# EAGLE design ESP8266-1W-I2C-Gateway_V2.00 (EAGLE 7.7.0)
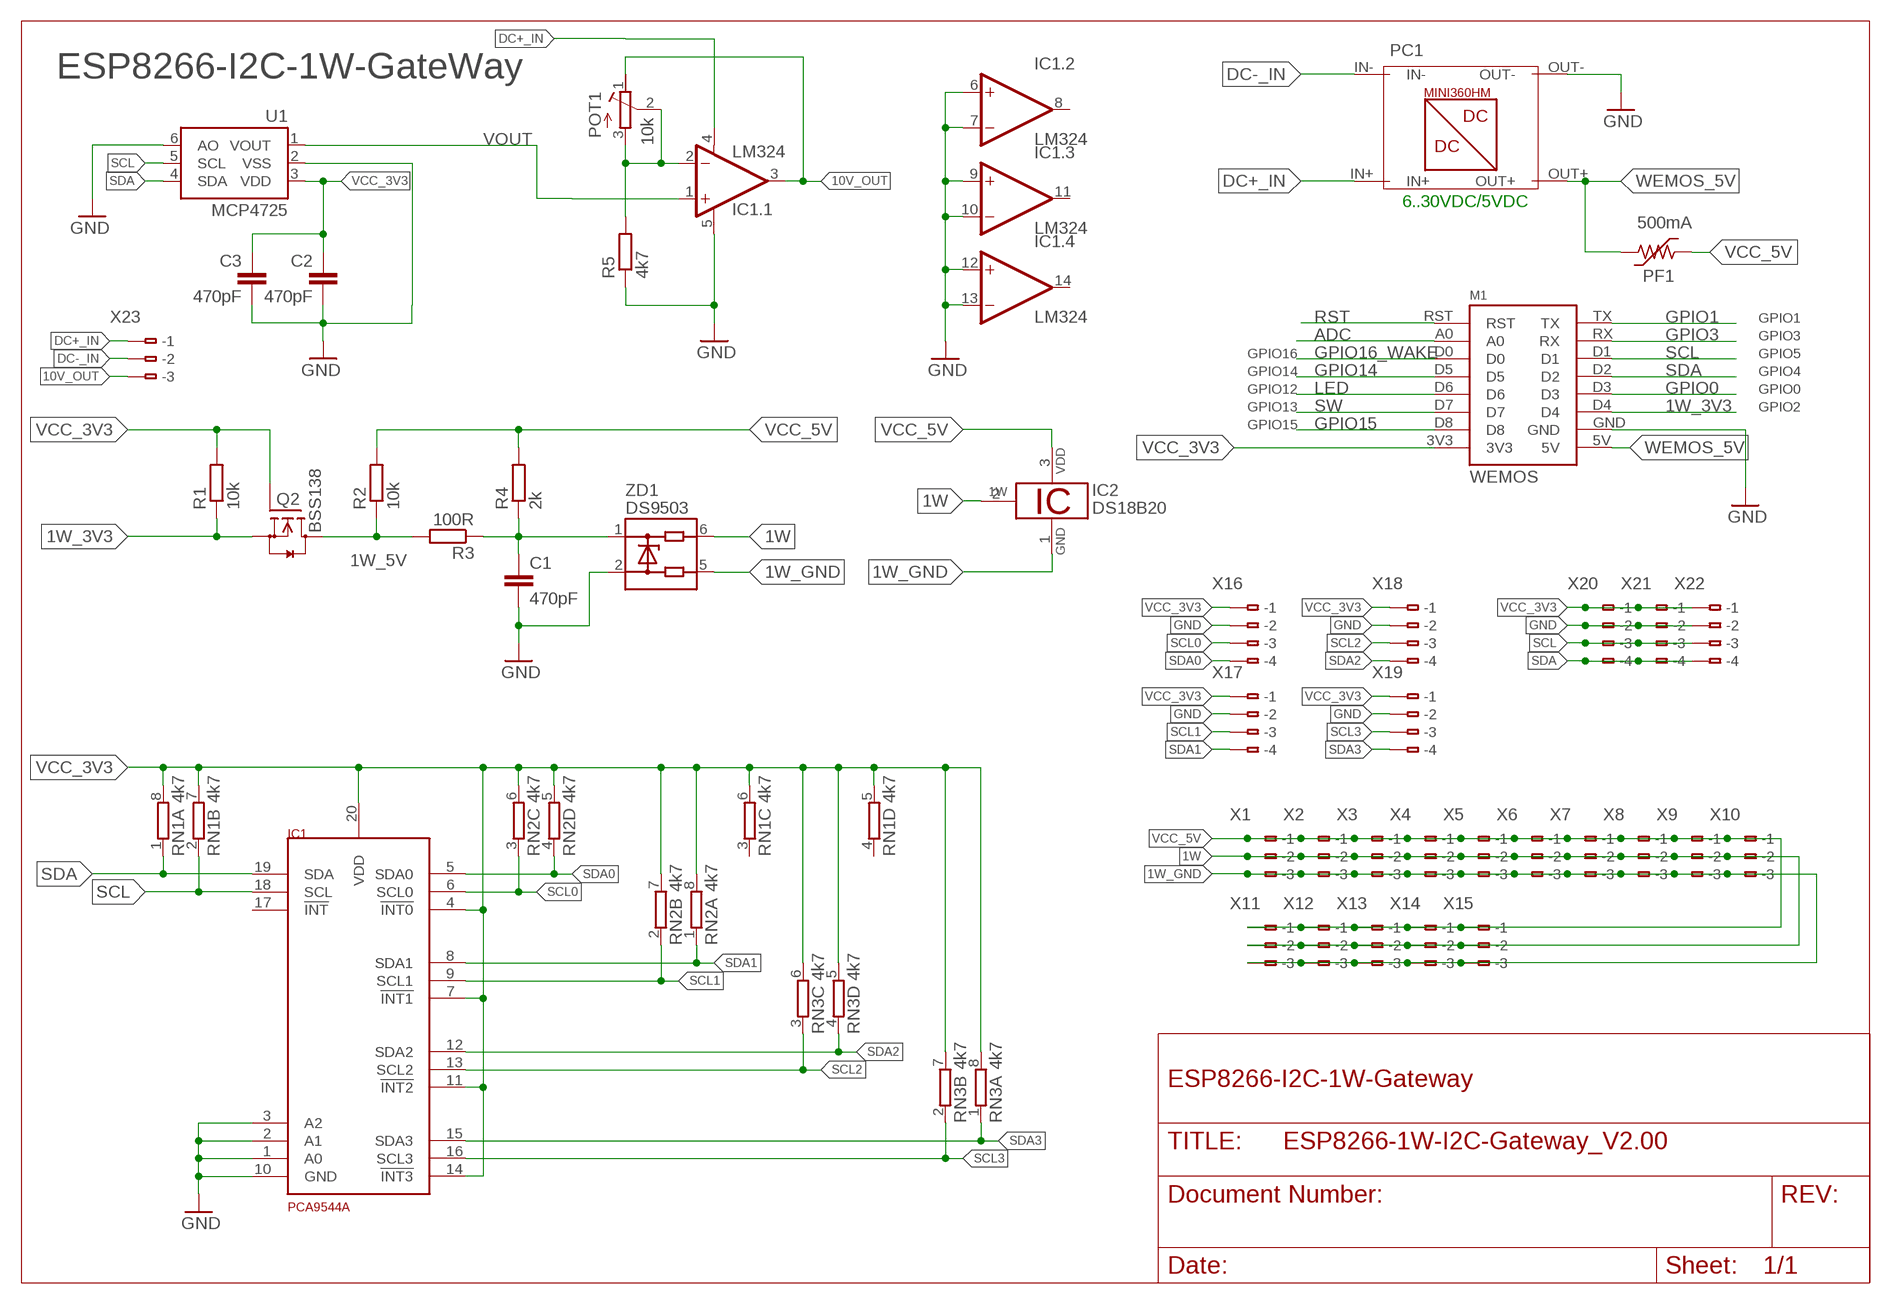
[diagram p0: schematic, sheet 1]

## Parts
C1  470pF  C-EUC0805  [C0805]
C2  470pF  C-EUC0805  [C0805]
C3  470pF  C-EUC0805  [C0805]
IC1  PCA9544A  [TSSOP20]
IC1.  LM324  [2QSP14]
IC2  DS18B20  [TO92-]
M1  WEMOS  [WEMOS]
PC1  MINI360HMTHROUGH-HOLE  [MINI360HM]
PF1  500mA  PTC-F1206  [F1206]
POT1  10k  BOURN_SMD_POTENTIOMETER2.1X2.7MMPACKAGE  [BOURN_SMD_POTENTIOMETER]
Q2  BSS138  [SOT23]
R1  10k  R-EU_R0805  [R0805]
R2  10k  R-EU_R0805  [R0805]
R3  100R  R-EU_R0805  [R0805]
R4  2k  R-EU_R0805  [R0805]
R5  4k7  R-EU_R0805  [R0805]
RN1  4k7  4R-N0603-ARC  [0603-ARC]
RN2  4k7  4R-N0603-ARC  [0603-ARC]
RN3  4k7  4R-N0603-ARC  [0603-ARC]
U1  MCP4725  MCP4725SOT-23  [SOT23-6]
X1  MINI_3X  [MINI_3X]
X2  MINI_3X  [MINI_3X]
X3  MINI_3X  [MINI_3X]
X4  MINI_3X  [MINI_3X]
X5  MINI_3X  [MINI_3X]
X6  MINI_3X  [MINI_3X]
X7  MINI_3X  [MINI_3X]
X8  MINI_3X  [MINI_3X]
X9  MINI_3X  [MINI_3X]
X10  MINI_3X  [MINI_3X]
X11  MINI_3X  [MINI_3X]
X12  MINI_3X  [MINI_3X]
X13  MINI_3X  [MINI_3X]
X14  MINI_3X  [MINI_3X]
X15  MINI_3X  [MINI_3X]
X16  MINI_4X  [MINI_4X]
X17  MINI_4X  [MINI_4X]
X18  MINI_4X  [MINI_4X]
X19  MINI_4X  [MINI_4X]
X20  MINI_4X  [MINI_4X]
X21  MINI_4X  [MINI_4X]
X22  MINI_4X  [MINI_4X]
X23  MINI_3X  [MINI_3X]
ZD1  DS9503  DS9503_BYPASS_JP  [TSOC6_BYPASS_J]

## Nets
1W: IC2.2(1W) X1.B-2(-2) X2.B-2(-2) X3.B-2(-2) X4.B-2(-2) X5.B-2(-2) X6.B-2(-2) X7.B-2(-2) X8.B-2(-2) X9.B-2(-2) X10.B-2(-2) X11.B-2(-2) X12.B-2(-2) X13.B-2(-2) X14.B-2(-2) X15.B-2(-2) ZD1.6
1W_3V3: M1.D4 Q2.2(S) R1.1
1W_5V: Q2.3(D) R2.1 R3.2
1W_GND: IC2.1(GND) X1.B-3(-3) X2.B-3(-3) X3.B-3(-3) X4.B-3(-3) X5.B-3(-3) X6.B-3(-3) X7.B-3(-3) X8.B-3(-3) X9.B-3(-3) X10.B-3(-3) X11.B-3(-3) X12.B-3(-3) X13.B-3(-3) X14.B-3(-3) X15.B-3(-3) ZD1.5
10V_OUT: IC1..3(1:OUT) POT1.1(A) X23.B-3(-3)
ADC: M1.A0
DC+_IN: IC1..4(1:V+) PC1.IN+ X23.B-1(-1)
DC-_IN: PC1.IN- X23.B-2(-2)
GND: C1.2 C2.2 C3.2 IC1.1(A0) IC1.2(A1) IC1.3(A2) IC1.10(GND) IC1..5(1:V-) IC1..6(2:+IN) IC1..7(2:-IN) IC1..9(3:+IN) IC1..10(3:-IN) IC1..12(4:+IN) IC1..13(4:-IN) M1.GND PC1.OUT- R5.1 U1.2(VSS) U1.6(AO) X16.B-2(-2) X17.B-2(-2) X18.B-2(-2) X19.B-2(-2) X20.B-2(-2) X21.B-2(-2) X22.B-2(-2) ZD1.2
GPIO0: M1.D3
GPIO1: M1.TX
GPIO3: M1.RX
GPIO14: M1.D5
GPIO15: M1.D8
GPIO16_WAKE: M1.D0
LED: M1.D6
N$4: IC1..2(1:-IN) POT1.2(S) POT1.3(E) R5.2
N$5: C1.1 R3.1 R4.1 ZD1.1
RST: M1.RST
SCL: IC1.18(SCL) M1.D1 RN1.2 U1.5(SCL) X20.B-3(-3) X21.B-3(-3) X22.B-3(-3)
SCL0: IC1.6(SCL0) RN2.3 X16.B-3(-3)
SCL1: IC1.9(SCL1) RN2.2 X17.B-3(-3)
SCL2: IC1.13(SCL2) RN3.3 X18.B-3(-3)
SCL3: IC1.16(SCL3) RN3.2 X19.B-3(-3)
SDA: IC1.19(SDA) M1.D2 RN1.1 U1.4(SDA) X20.B-4(-4) X21.B-4(-4) X22.B-4(-4)
SDA0: IC1.5(SDA0) RN2.4 X16.B-4(-4)
SDA1: IC1.8(SDA1) RN2.1 X17.B-4(-4)
SDA2: IC1.12(SDA2) RN3.4 X18.B-4(-4)
SDA3: IC1.15(SDA3) RN3.1 X19.B-4(-4)
SW: M1.D7
VCC_3V3: C2.1 C3.1 IC1.4(!INT0) IC1.7(!INT1) IC1.11(!INT2) IC1.14(!INT3) IC1.20(VDD) M1.3V3 Q2.1(G) R1.2 RN1.5 RN1.6 RN1.7 RN1.8 RN2.5 RN2.6 RN2.7 RN2.8 RN3.5 RN3.6 RN3.7 RN3.8 U1.3(VDD) X16.B-1(-1) X17.B-1(-1) X18.B-1(-1) X19.B-1(-1) X20.B-1(-1) X21.B-1(-1) X22.B-1(-1)
VCC_5V: IC2.3(VDD) PF1.1 R2.2 R4.2 X1.B-1(-1) X2.B-1(-1) X3.B-1(-1) X4.B-1(-1) X5.B-1(-1) X6.B-1(-1) X7.B-1(-1) X8.B-1(-1) X9.B-1(-1) X10.B-1(-1) X11.B-1(-1) X12.B-1(-1) X13.B-1(-1) X14.B-1(-1) X15.B-1(-1)
VOUT: IC1..1(1:+IN) U1.1(VOUT)
WEMOS_5V: M1.5V PC1.OUT+ PF1.2
Unconnected: IC1.17(!INT) IC1..8(2:OUT) IC1..11(3:OUT) IC1..14(4:OUT) RN1.3 RN1.4

## Notes on the sheet
- ESP8266-I2C-1W-GateWay
- 6..30VDC/5VDC
- GPIO1
- GPIO3
- GPIO16 | GPIO5
- GPIO14 | GPIO4
- GPIO12 | GPIO0
- GPIO13 | GPIO2
- GPIO15
- ESP8266-I2C-1W-Gateway

## Library data of the parts
C1-C3 = resistor:C-EU: CAPACITOR, European symbol
IC1 = DSSCircuits:PCA9544A
IC1. = seanvoisen:LM324: LM324 Quad Op-amp
IC2 = my:DS18B20: Programmable Resolution Digital Thermometer This chip provides a onewire thermosensor with approx. 0.5°C accuracy. A programmable over/undertemperure alarm is available. The precision can be set from 9..12 bits. Notes: Vdd must be applied for accurate measurements at low temperatures, as the parasite power circuit otherwise heats the sensor. If parasite power is used, Vdd has to be connected to GND. The DS1822 is a low-cost thermometer chip, the DS18S20 is similar to the DS18B20, but with 9 Bit precision only. Author: Jan Kandziora <jjj@gmx.de>
M1 = 1455413453956-wemos:WEMOS
PC1 = ESP8266_1wire_Gateway_V1.15:MINI360HM
PF1 = polyswitch:PTC-: POLYSWITCH Polyswitch Resetable Fuses
POT1 = bourn_smd_potentiometers:BOURN_SMD_POTENTIOMETER: Bourn : SMD Potentiometer Part #: PVZ2A103C04B00 Mouser: http://www.mouser.com/ProductDetail/Murata-Electronics/PVZ2A103C04B00/?qs=sGAEpiMZZMvygUB3GLcD7qR9snKKmVdv8nMA43nZMQ4%3d Digikey: http://www.digikey.com/scripts/dksearch/dksus.dll?pv7=2&k=PVZ2A103C04B00&mnonly=0&newproducts=0&ColumnSort=0&page=1&quantity=0&ptm=0&fid=0&pageSize=25 Dimensions: (2.1mm x 2.7mm) http://search.murata.co.jp/Ceramy/CatalogshowpageAction.do?sParam=PVZ2A&sKno=G002&sTblid=A002&sDirnm=A00X&sFilnm=PVZ2A4DM&sType=2&sLang=en&sNHinnm=PVZ2A103C04B00&sCapt=Dimensions
Q2 = my:BSS138: Fairchild Semiconductors BSS138 N-Channel Logic Level Enhancement Mode Field Effect Transistor General Description: These N-Channel enhancement mode field effect transistors are produced using Fairchild's proprietary, high cell density, DMOS technology. These products have been designed to minimize on-state resistance while provide rugged, reliable, and fast switching performance.These products are particularly suited for low voltage, low current applications such as small servo motor control, power MOSFET gate drivers, and other switching applications. Features: 0.22 A, 50 V. RDS(ON) = 3.5Ohm @ VGS = 10 V RDS(ON) = 6.0Ohm @ VGS = 4.5 V High density cell design for extremely low RDS(ON) Rugged and Reliable Compact industry standard SOT-23 surface mount package Please send any comments to: messi@users.sourceforge.net
R1-R5 = rcl:R-EU_: RESISTOR, European symbol
RN1-RN3 = resistor-dil:4R-N: Array Chip Resistor Source: RS Component / Phycomp; OC_FARNELL: unknown; OC_NEWARK: unknown
U1 = SparkFun-AnalogIC:MCP4725: Microchip 12-bit I2C DAC, SOT23-6; PROD_ID: IC-08886
X1-X15 X23 = Terminal-2 - 3,5x5:MINI_3X: ChinaMini_3x
X16-X22 = Terminal-2 - 3,5x5:MINI_4X: ChinaMini_3x
ZD1 = my:DS9503_BYPASS_J: ESD Protection Diode with Resistors This ESD protection diode is designed especially for onewire host interfaces. Unlike the DS9502, it has two additional 5Ohm resitors in the 1W and GND line. Pin 5 and 6 have to be connected to the host side, pin 1 und 2 to the network side. The 1W line is through pin 1 and 6, the GND line is through pin 2 and 5. Author: Jan Kandziora <jjj@gmx.de>

## Board
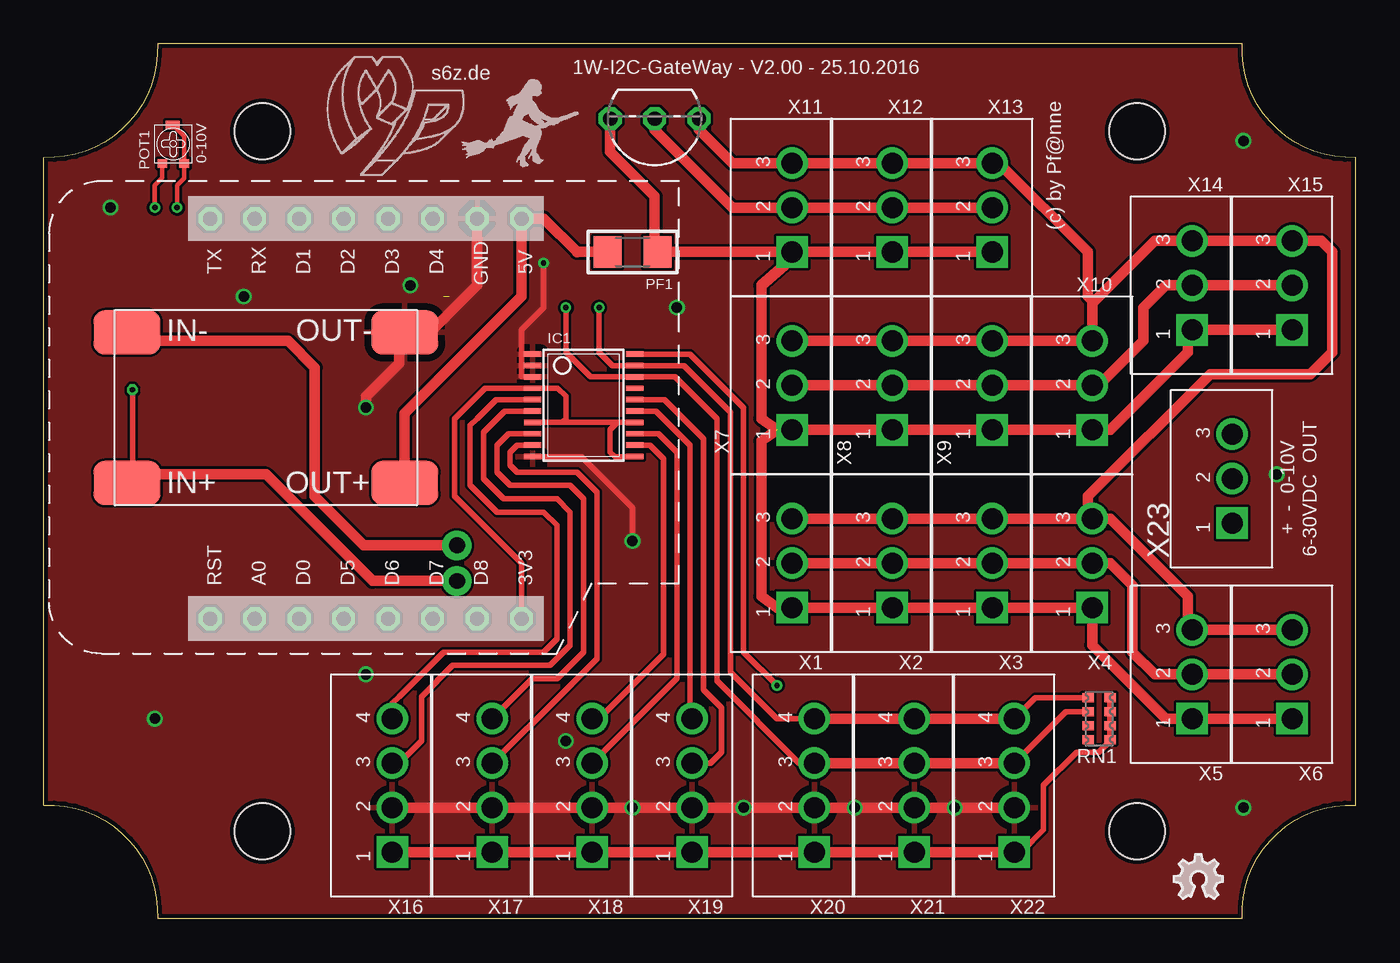
[diagram p1: board, top side]
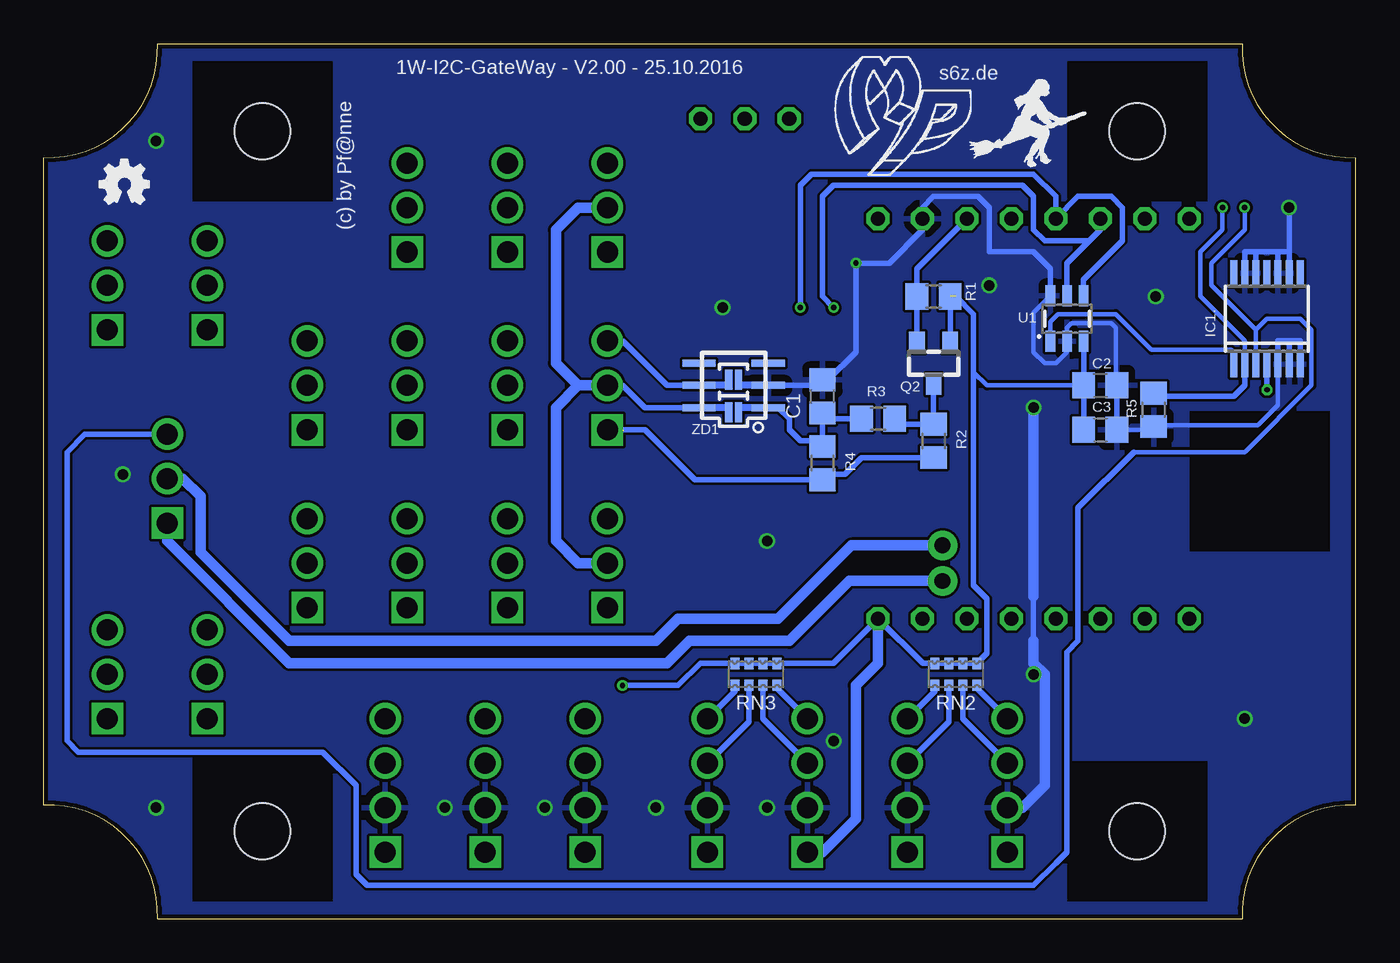
[diagram p2: board, bottom side, seen from below]

Size 75 x 50 mm. Coordinates in mm from the lower left corner, seen from the top.
Outline: 0,6.5 0,43.5 arc95 6.5,50 68.5,50 arc95 75,43.5 75,6.5 arc95 68.5,0 6.5,0 arc95 0,6.5
Copper layers (1*16): Top 0.035mm / dielectric 1.5mm / Bottom 0.035mm
Design rules "ITEADstudio_DRC *": minimum track width 16mil, minimum drill 12mil, track to track 6mil, track to pad 10mil, pad to pad 6mil, via to via 6mil, smd to smd 0mil, copper to edge 10mil, drill to drill 10mil, minimum pad ring 10mil, minimum via ring 6mil, stop-mask expansion 2mil, vias tented up to drill 100mil, thermal gap 16mil
Holes 3.2 mm at 12.5,5 12.5,45 62.5,45 62.5,5
bRestrict: area 8.5,1 to 16.5,9; area 8.5,41 to 16.5,49; area 58.5,41 to 66.5,49; area 58.5,1 to 66.5,9; area 1.5,21 to 9.5,29

### Footprints (pad centres in the part's own frame; a part is rotated, then mirrored left to right if it is on the bottom)
C0805 = smd 1.3 x 1.5: 1 -0.95,0; 2 0.95,0
TSSOP20 = smd 0.305 x 0.991: 1 -2.925,-2.918; 2 -2.275,-2.918; 3 -1.625,-2.918; 4 -0.975,-2.918; 5 -0.325,-2.918; 6 0.325,-2.918; 7 0.975,-2.918; 8 1.625,-2.918; 9 2.275,-2.918; 10 2.925,-2.918; 11 2.925,2.918; 12 2.275,2.918; 13 1.625,2.918; 14 0.975,2.918; 15 0.325,2.918; 16 -0.325,2.918; 17 -0.975,2.918; 18 -1.625,2.918; 19 -2.275,2.918; 20 -2.925,2.918
2QSP14 = smd 0.4 x 1.5: 1 -1.905,-2.6; 2 -1.27,-2.6; 3 -0.635,-2.6; 4 0,-2.6; 5 0.635,-2.6; 6 1.27,-2.6; 7 1.905,-2.6; 8 1.905,2.6; 9 1.27,2.6; 10 0.635,2.6; 11 0,2.6; 12 -0.635,2.6; 13 -1.27,2.6; 14 -1.905,2.6
TO92- = drill 0.813 octagon: 1 -2.54,0; 2 0,0; 3 2.54,0
WEMOS = drill 0.8 octagon: 3V3 0,0; 5V 22.86,0; A0 0,15.24; D0 0,12.7; D1 22.86,12.7; D2 22.86,10.16; D3 22.86,7.62; D4 22.86,5.08; D5 0,10.16; D6 0,7.62; D7 0,5.08; D8 0,2.54; GND 22.86,2.54; RST 0,17.78; RX 22.86,15.24; TX 22.86,17.78
MINI360HM = smd 3.81 x 2.5: IN+ -7.935,-4.3; IN- -7.935,4.3; OUT+ 7.935,-4.3; OUT- 7.935,4.3
F1206 = smd 1.6 x 1.803: 1 -1.429,0; 2 1.429,0
BOURN_SMD_POTENTIOMETER = smd 0.55 x 0.5: 1 0.432,-0.018; 3 1.682,-0.018 | smd 0.8 x 0.5: 2 1.032,2.182
SOT23 = smd 0.9 x 1.2: 1 -0.95,-1.2; 2 0.95,-1.2; 3 0,1.2
R0805 = smd 1.3 x 1.5: 1 -0.95,0; 2 0.95,0
0603-ARC = smd 0.5 x 0.65: 1 -1.2,-0.625; 2 -0.4,-0.625; 3 0.4,-0.625; 4 1.2,-0.625; 5 1.2,0.625; 6 0.4,0.625; 7 -0.4,0.625; 8 -1.2,0.625
SOT23-6 = smd 0.55 x 1.2: 1 0.95,1.3; 2 0,1.3; 3 -0.95,1.3; 4 -0.95,-1.3; 5 0,-1.3; 6 0.95,-1.3
MINI_3X = drill 1.2 square: B-1 2.54,2.3 | drill 1.2: B-2 5.08,2.3; B-3 7.62,2.3
MINI_4X = drill 1.2 square: B-1 2.54,2.3 | drill 1.2: B-2 5.08,2.3; B-3 7.62,2.3; B-4 10.16,2.3
TSOC6_BYPASS_J = smd 0.406 x 1.905: 1 -1.27,-1.981; 2 0,-1.981; 3 1.27,-1.981; 4 1.27,1.981; 5 0,1.981; 6 -1.27,1.981 | smd 1.143 x 0.406: 9 -1.524,-0.274; 10 -1.524,0.286; 11 0.33,-0.274; 12 0.33,0.286

### Placement (x,y rotation side)
C1  30.48,29.84 90 bottom
C2  14.61,30.48 0 bottom
C3  14.61,27.94 0 bottom
IC1  30.86,29.34 270 top
IC1.  5.08,34.29 0 bottom
IC2  34.92,45.72 180 top
M1  27.3,17.14 90 top
PC1  12.7,29.21 0 top
PF1  33.66,38.1 180 top
POT1  6.35,43.18 0 top
Q2  24.13,31.75 180 bottom
R1  24.13,35.56 0 bottom
R2  24.13,27.3 270 bottom
R3  27.3,28.57 0 bottom
R4  30.48,26.04 270 bottom
R5  11.56,29.08 90 bottom
RN1  60.33,11.43 270 top
RN2  22.86,13.97 0 bottom
RN3  34.29,13.97 0 bottom
U1  16.51,34.29 180 bottom
U$1  [OSHW_FILLX100_NOTEXT]  64.59,1.14 0 top
U$2  [OSHW_FILLX100_NOTEXT]  71.81,40.84 0 bottom
X1  45.09,15.24 90 top
X2  50.8,15.24 90 top
X3  56.52,15.24 90 top
X4  62.23,15.24 90 top
X5  67.94,8.89 90 top
X6  73.66,8.89 90 top
X7  45.09,25.4 90 top
X8  50.8,25.4 90 top
X9  56.52,25.4 90 top
X10  62.23,25.4 90 top
X11  45.09,35.56 90 top
X12  50.8,35.56 90 top
X13  56.52,35.56 90 top
X14  67.94,31.11 90 top
X15  73.66,31.11 90 top
X16  22.23,1.27 90 top
X17  27.94,1.27 90 top
X18  33.66,1.27 90 top
X19  39.37,1.27 90 top
X20  46.35,1.27 90 top
X21  52.07,1.27 90 top
X22  57.78,1.27 90 top
X23  70.23,20.07 90 top
ZD1  35.56,30.48 90 bottom

### Tracks (layer width: path | path; a pad name or v marks a point on that pad's centre or on a via)
1W
  Top 0.61: X6.B-2 X5.B-2 63.5,13.97 62.23,15.24 62.23,16.51 62.23,19.05 60.96,20.32 60.53,20.32 X4.B-2 X3.B-2 X2.B-2 X1.B-2 | X15.B-2 X14.B-2 64.14,36.2 62.87,34.92 62.87,33.02 60.33,30.48 X10.B-2 X9.B-2 X8.B-2 X7.B-2 | X13.B-2 X12.B-2 X11.B-2 39.37,40.64 34.92,45.09 IC2.2
  Bottom 0.305: ZD1.6 40.64,29.21 41.91,30.48 X7.B-2
  Bottom 0.61: 44.45,30.48 45.72,31.75 45.72,39.37 44.45,40.64 X11.B-2 | 44.45,30.48 X7.B-2 | X1.B-2 44.45,20.32 45.72,21.59 45.72,29.21 44.45,30.48
1W_3V3
  Bottom 0.305: M1.D4 25.08,37.15 R1.1 Q2.2
1W_5V
  Bottom 0.305: Q2.3 R2.1 26.04,28.25 R3.2
1W_GND
  Top 0.61: X6.B-3 X5.B-3 65.41,16.75 65.41,18.41 60.96,22.86 X4.B-3 59.69,22.86 | 59.69,22.86 X3.B-3 X2.B-3 X1.B-3 | X7.B-3 X8.B-3 X9.B-3 X10.B-3 59.93,35.16 60.01,35.24 | IC2.1 37.47,45.09 39.37,43.18 X11.B-3 X12.B-3 X13.B-3 54.61,43.18 59.69,38.1 59.69,35.56 60.01,35.24 | 60.01,35.24 63.5,38.73 X14.B-3 X15.B-3 73.03,38.73 73.66,38.1 73.66,32.38 72.39,31.11 66.67,31.11 59.69,24.13 59.69,22.86
  Bottom 0.305: ZD1.5 39.37,30.48 40.64,31.75 41.91,33.02 X7.B-3
10V_OUT  (via drill 0.3)
  Top 0.254: POT1.1 6.78,42.34 6.35,41.91 v6.35,40.64
  Bottom 0.254: v6.35,40.64 6.35,39.37 8.26,37.47 8.26,36.2 5.71,33.66 | 5.71,33.66 IC1..3 5.71,33.66 | 5.71,33.66 5.08,34.29 3.17,34.29 2.54,33.66 2.54,30.48 6.35,26.67 12.7,26.67
  Bottom 0.305: X23.B-3 72.64,27.69 73.66,26.67 73.66,10.16 73.03,9.53 62.23,9.53 59.05,9.53 57.15,7.62 57.15,2.54 56.52,1.91 18.41,1.91 17.14,3.17 16.51,3.81 16.51,15.24 15.88,15.88 15.88,18.41 15.88,23.5 12.7,26.67
DC+_IN  (via drill 0.3, 0.9 pad 1.68)
  Top 0.305: v5.08,30.23 5.08,25.4 5.17,25.31
  Top 0.406: 5.17,25.31 4.76,25.31 PC1.IN+
  Top 0.61: 5.25,25.4 5.17,25.31 5.25,25.4 | v23.62,19.3 18.8,19.3 12.7,25.4 5.25,25.4
  Bottom 0.305: 47.62,14.61 48.26,14.61 | IC1..4 v5.08,30.23
  Bottom 0.61: v23.62,19.3 28.96,19.3 32.38,15.88 38.1,15.88 39.37,14.61 48.26,14.61 60.96,14.61 67.94,21.59 67.94,22.59 X23.B-1
DC-_IN  (via drill 0.9 pad 1.68)
  Top 0.406: PC1.IN- 5.08,33.51 5.08,33.02 5.25,33.02
  Top 0.61: v23.62,21.34 18.29,21.34 15.49,24.13 15.49,31.5 13.97,33.02 5.25,33.02
  Bottom 0.61: v23.62,21.34 28.19,21.34 28.83,21.34 33.02,17.14 38.73,17.14 40.01,15.88 60.96,15.88 66.04,20.95 66.04,24.13 67.06,25.15 X23.B-2
GND  (via drill 0.3, 0.6)
  Top 0.305: IC1.1 27.3,32.26 | 21.73,33.66 21.59,33.51 | IC1.2 27.3,31.61 | 27.3,31.61 27.3,32.26 | IC1.3 27.3,30.96 27.3,31.61 | IC1.10 28.95,26.41 30.74,26.41 33.66,23.5 v33.66,21.59 | 27.3,32.26 27.3,33.66 28.57,34.92 v28.57,37.47
  Top 0.406: PC1.OUT- 20.32,33.51 20.32,33.02
  Top 0.61: X22.B-2 X21.B-2 X20.B-2 X19.B-2 X18.B-2 X17.B-2 X16.B-2 | 21.59,33.51 22.08,33.51 24.77,36.2 M1.GND | v18.41,29.21 18.41,29.84 20.32,31.75 20.32,33.02 20.32,33.2
  Bottom 0.254: C2.2 13.72,30.54 13.72,33.78 13.97,34.04 16.26,34.04 16.51,33.78 U1.2 16.51,32.38 17.14,31.75 17.78,31.75 18.41,32.38 18.41,34.63 U1.6 | C3.2 11.75,27.94 R5.1 11.5,28.19 5.59,28.19 4.45,29.34 4.45,30.48 IC1..5
  Bottom 0.305: M1.GND 24.77,39.37 26.67,37.47 v28.57,37.47 28.57,32.38 30.16,30.8 C1.2 30.8,30.48 ZD1.2 | C2.2 C3.2 | 24.77,40.64 24.13,41.27 21.59,41.27 20.95,40.64 20.95,38.1 18.41,38.1 17.78,37.47 17.46,37.15 U1.6 | 18.41,15.88 18.41,18.41 | 3.81,33.02 IC1..6 3.81,33.02 | 3.81,33.02 3.17,33.02 IC1..7 | 3.81,38.1 IC1..9 3.81,38.1 | 3.81,38.1 v3.81,40.64 | 5.71,38.1 IC1..12 5.71,38.1 | 5.71,38.1 6.35,38.1 IC1..13 | 5.71,38.1 4.45,38.1 | 4.45,38.1 IC1..10 4.45,38.1 | 3.81,38.1 4.45,38.1 | 3.81,33.02 4.45,33.02 IC1..5
  Bottom 0.61: X16.B-2 19.05,6.35 17.78,7.62 17.78,13.97 18.41,14.61 18.41,15.88 | v18.41,29.21 18.41,18.41
  other vias: 6.35,11.43 68.58,44.45 68.58,6.35 52.07,6.35 46.35,6.35 40.01,6.35 33.66,6.35 29.84,10.16 18.41,13.97 11.43,35.56 20.95,36.2 36.2,34.92 70.48,25.4
  pour Top: 6.35,50.8 68.58,50.8 arc-90 76.2,43.18 76.2,6.35 arc-90 68.58,-1.27 6.35,-1.27 arc-90 -1.27,6.35 -1.27,43.18 arc-90
  pour Bottom: 6.35,50.8 68.58,50.8 arc-90 76.2,43.18 76.2,6.35 arc-90 68.58,-1.27 6.35,-1.27 arc-90 -1.27,6.35 -1.27,43.18 arc-90
N$4  (via drill 0.3)
  Top 0.254: POT1.2 8.03,44.71 POT1.3 8.03,42.32 7.62,41.91 v7.62,40.64
  Bottom 0.254: IC1..2 6.35,33.02 8.89,35.56 8.89,37.47 8.89,38.1 7.62,39.37 v7.62,40.64
  Bottom 0.305: IC1..2 6.35,30.48 6.99,29.84 11.37,29.84 R5.2
N$5
  Bottom 0.305: R3.1 30.16,28.57 C1.1 R4.1 30.8,27.3 31.75,27.3 32.38,27.94 32.38,28.57 33.02,29.21 ZD1.1
SCL  (via drill 0.3)
  Top 0.305: v29.84,34.92 29.84,32.38 31.27,30.96 IC1.18 36.09,30.96 38.48,28.57 38.48,15.24 38.48,13.59 43.18,8.89 X20.B-3 | RN1.2 58.42,11.83 X22.B-3
  Top 0.61: X20.B-3 X21.B-3 X22.B-3
  Bottom 0.305: M1.D1 14.61,39.37 15.24,38.73 | 15.24,38.73 17.78,38.73 18.41,39.37 18.41,41.27 19.05,41.91 29.21,41.91 29.84,41.91 30.48,41.27 30.48,40.64 30.48,36.83 30.48,35.56 v29.84,34.92 | 15.24,38.73 16.51,37.47 U1.5
SCL0
  Top 0.305: IC1.6 26.34,29.01 25.15,27.81 25.15,25.15 26.29,24 29.34,24 30.1,23.24 30.1,18.67 30.1,15.62 28.96,14.48 28.57,14.48 23.37,14.48 21.59,12.7 21.59,10.16 20.32,8.89 X16.B-3
  Bottom 0.305: RN2.3 22.46,11.43 X16.B-3
SCL1
  Top 0.305: IC1.9 27.06,27.06 26.67,26.67 26.67,25.91 27.05,25.53 30.48,25.53 31.62,24.38 31.62,18.67 31.62,14.86 29.72,12.95 29.7,12.95 X17.B-3
  Bottom 0.305: RN2.2 23.26,11.27 X17.B-3
SCL2
  Top 0.305: IC1.13 35.15,27.71 36.2,26.67 36.2,15.24 36.2,13.73 X18.B-3
  Bottom 0.305: RN3.3 33.89,11.43 X18.B-3
SCL3
  Top 0.305: IC1.16 35.49,29.66 37.72,27.43 37.72,15.24 37.72,13.08 38.73,12.06 38.73,9.53 38.1,8.89 X19.B-3
  Bottom 0.305: RN3.2 34.69,11.27 X19.B-3
SDA  (via drill 0.3)
  Top 0.305: v31.75,34.92 31.75,32.38 32.52,31.61 IC1.19 36.59,31.61 39.24,28.96 39.24,15.24 39.24,14.1 41.91,11.43 X20.B-4 | RN1.1 56.69,12.63 X22.B-4
  Top 0.61: X20.B-4 X21.B-4 X22.B-4
  Bottom 0.305: v31.75,34.92 31.75,41.91 31.11,42.55 18.41,42.55 17.14,41.27 M1.D2 15.88,41.27 13.97,41.27 13.34,40.64 13.34,38.73 15.56,36.51 U1.4
SDA0
  Top 0.305: IC1.5 25.85,29.66 24.77,28.57 24.38,28.19 24.38,24.77 25.91,23.24 28.57,23.24 29.34,22.48 29.34,18.67 29.34,16 28.57,15.24 22.86,15.24 20.32,12.7 19.93,12.3 X16.B-4
  Bottom 0.305: RN2.4 21.66,13.16 X16.B-4
SDA1
  Top 0.305: IC1.8 26.57,27.71 25.91,27.05 25.91,25.53 26.67,24.77 30.1,24.77 30.86,24 30.86,18.67 30.86,15.24 29.34,13.72 27.93,13.72 X17.B-4
  Bottom 0.305: RN2.1 24.06,13.01 X17.B-4
SDA2
  Top 0.305: IC1.12 34.66,27.06 35.43,26.29 35.43,25.53 35.43,15.24 35.43,15.11 31.75,11.43 X18.B-4
  Bottom 0.305: RN3.4 33.09,13.16 X18.B-4
SDA3
  Top 0.305: IC1.15 35,29.01 36.96,27.05 36.96,15.24 36.96,11.54 X19.B-4
  Bottom 0.305: RN3.1 35.49,13.01 X19.B-4
VCC_3V3  (via drill 0.3)  (1 unrouted)
  Top 0.305: RN1.8 RN1.7 RN1.6 RN1.5 60.95,10.17 60.96,10.16 60.33,9.53 59.05,9.53 57.15,7.62 57.15,5.08 55.88,3.81 X22.B-1 | IC1.20 36.95,32.26 40.01,29.21 40.01,15.24 v41.91,13.34 | M1.3V3 27.3,20.32 23.5,24.13 23.5,28.57 25.23,30.31 IC1.4 29.38,30.31 29.84,29.84 29.84,29.21 29.84,28.57 29.63,28.36 29.21,28.36 | IC1.7 29.21,28.36 | IC1.11 32.64,26.41 32.38,26.67 32.38,27.94 32.81,28.36 IC1.14 29.21,28.36
  Top 0.61: X16.B-1 X17.B-1 X18.B-1 X19.B-1 X20.B-1 X21.B-1 X22.B-1
  Bottom 0.254: 15.75,30.48 21.08,30.48 21.84,31.24 21.84,31.75
  Bottom 0.305: RN3.8 34.23,14.61 34.92,14.61 | R1.2 Q2.1 | 22.86,35.56 21.84,34.54 21.84,31.75 21.84,19.05 21.08,18.29 21.08,15.17 RN2.5 RN2.6 RN2.7 RN2.8 24.75,14.6 M1.3V3 29.86,14.6 RN3.5 RN3.6 RN3.7 RN3.8 | v41.91,13.34 38.73,13.34 37.47,14.61 RN3.8 | U1.3 C2.1 | C3.1 C2.1 | C2.1 15.75,30.48
  Bottom 0.61: M1.3V3 27.3,14.61 28.57,13.34 28.57,5.71 30.48,3.81 X18.B-1
VCC_5V  (1 unrouted)
  Top 0.61: X1.B-1 43.18,17.78 | 43.18,17.78 X2.B-1 X3.B-1 X4.B-1 59.93,15.63 64.14,11.43 X5.B-1 X6.B-1 | X15.B-1 X14.B-1 65.41,33.41 65.41,32.38 60.96,27.94 X10.B-1 X9.B-1 X8.B-1 | X8.B-1 48.26,27.94 | X11.B-1 43.18,38.1 X12.B-1 X13.B-1 | X11.B-1 PF1.1 34.92,38.26 34.92,41.27 32.38,43.81 IC2.3 | X7.B-1 41.91,27.94 | X7.B-1 41.91,27.94 | X7.B-1 X8.B-1 | X11.B-1 42.78,37.7 41.02,36.2 41.02,28.57 41.91,27.94 | 42.29,27.89 41.86,27.89 41.02,27.3 41.02,18.41 41.91,17.78 43.18,17.78
  Bottom 0.305: X7.B-1 40.64,27.94 37.78,25.09 R4.2 30.16,25.4 29.21,25.4 28.25,26.36 R2.2
VOUT
  Bottom 0.254: U1.1 17.46,34.1 17.02,34.54 13.72,34.54 11.68,32.51 7.11,32.51 6.99,32.38 IC1..1
WEMOS_5V
  Top 0.61: PF1.2 30.48,38.1 28.57,40.01 M1.5V 27.3,35.56 20.64,28.89 PC1.OUT+

### Text on the board
tNames: s6z.de | 1W-I2C-GateWay - V2.00 - 25.10.2016 | 0-10V | (c) by Pf@nne | + - 0-10V | 6-30VDC OUT
bNames: s6z.de | 1W-I2C-GateWay - V2.00 - 25.10.2016 | (c) by Pf@nne